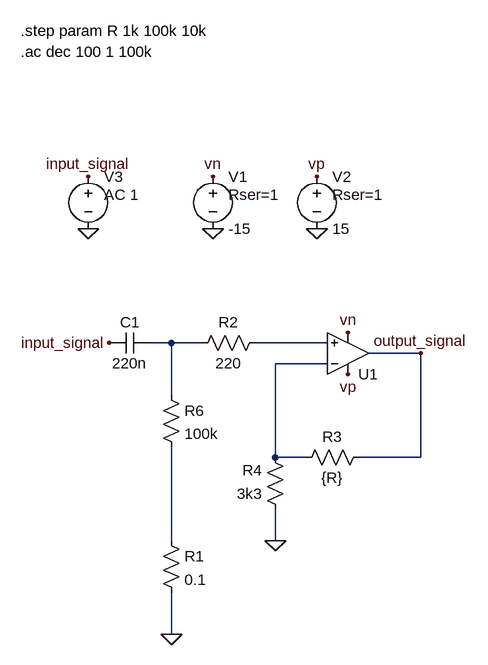
[diagram p0: schematic input_buffer.asc]
input_buffer.asc, the LTspice schematic file:
Version 4
SHEET 1 1152 680
WIRE -112 -144 -144 -144
WIRE -64 -144 -112 -144
WIRE 128 -144 16 -144
WIRE 272 -128 192 -128
WIRE 128 -112 48 -112
WIRE -112 -64 -112 -144
WIRE 48 32 48 -112
WIRE 96 32 48 32
WIRE 272 32 272 -128
WIRE 272 32 176 32
WIRE -112 160 -112 16
WIRE 48 160 48 112
WIRE -112 304 -112 240
FLAG 48 160 0
FLAG -112 304 0
FLAG 160 -96 vp
FLAG 112 -400 vp
FLAG 160 -160 vn
FLAG -48 -400 vn
FLAG -48 -320 0
FLAG 112 -320 0
FLAG -240 -400 input_signal
FLAG -208 -144 input_signal
FLAG 272 -128 output_signal
FLAG -240 -320 0
SYMBOL res -128 144 R0
SYMATTR InstName R1
SYMATTR Value 0.1
SYMBOL res 32 -160 R90
WINDOW 0 0 56 VBottom 2
WINDOW 3 32 56 VTop 2
SYMATTR InstName R2
SYMATTR Value 220
SYMBOL res 192 16 R90
WINDOW 0 0 56 VBottom 2
WINDOW 3 32 56 VTop 2
SYMATTR InstName R3
SYMATTR Value {R}
SYMBOL res 64 128 R180
WINDOW 0 36 76 Left 2
WINDOW 3 36 40 Left 2
SYMATTR InstName R4
SYMATTR Value 3k3
SYMBOL cap -144 -160 R90
WINDOW 0 0 32 VBottom 2
WINDOW 3 32 32 VTop 2
SYMATTR InstName C1
SYMATTR Value 220n
SYMBOL OpAmps\\UniversalOpAmp 160 -128 M180
SYMATTR InstName U1
SYMBOL voltage -48 -416 R0
WINDOW 123 0 0 Left 0
WINDOW 39 24 44 Left 2
SYMATTR InstName V1
SYMATTR Value -15
SYMATTR SpiceLine Rser=1
SYMBOL voltage 112 -416 R0
WINDOW 123 0 0 Left 0
WINDOW 39 24 44 Left 2
SYMATTR InstName V2
SYMATTR Value 15
SYMATTR SpiceLine Rser=1
SYMBOL voltage -240 -416 R0
WINDOW 123 24 44 Left 2
WINDOW 39 0 0 Left 0
SYMATTR InstName V3
SYMATTR Value ""
SYMATTR Value2 AC 1
SYMBOL res -128 -80 R0
SYMATTR InstName R6
SYMATTR Value 100k
TEXT -344 -592 Left 2 !.ac dec 100 1 100k
TEXT -344 -624 Left 2 !.step param R 1k 100k 10k

The netlist it stands for:
* input_buffer.asc
R1 N004 0 0.1
R2 N002 N001 220
R3 output_signal N003 {R}
R4 0 N003 3k3
C1 N001 input_signal 220n
XU1 N002 N003 vp vn output_signal level1 Avol=1Meg GBW=10Meg Vos=0 En=0 Enk=0 In=0 Ink=0 Rin=500Meg  ; pins In+ In- V+ V- OUT
V1 vn 0 -15 Rser=1
V2 vp 0 15 Rser=1
V3 input_signal 0 AC 1
R6 N001 N004 100k
.ac dec 100 1 100k
.step param R 1k 100k 10k
.lib UniversalOpAmp1.lib
.backanno
.end